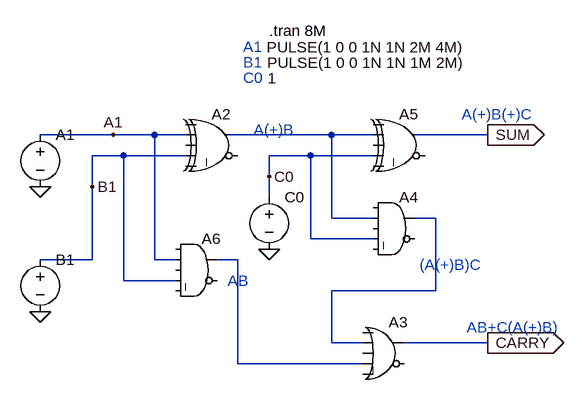
[diagram p0: schematic Draft29.asc]
Draft29.asc, the LTspice schematic file:
Version 4
SHEET 1 880 680
WIRE -16 16 -128 16
WIRE 48 16 -16 16
WIRE 96 16 48 16
WIRE 320 16 160 16
WIRE 384 16 320 16
WIRE 560 16 448 16
WIRE 0 48 -48 48
WIRE 96 48 0 48
WIRE 288 48 224 48
WIRE 384 48 288 48
WIRE 224 80 224 48
WIRE -48 96 -48 48
WIRE 224 112 224 80
WIRE 320 144 320 16
WIRE 384 144 320 144
WIRE 480 144 448 144
WIRE 288 176 288 48
WIRE 384 176 288 176
WIRE -48 208 -48 96
WIRE -48 208 -128 208
WIRE 48 208 48 16
WIRE 80 208 48 208
WIRE 176 208 144 208
WIRE 0 240 0 48
WIRE 80 240 0 240
WIRE 480 256 480 144
WIRE 480 256 320 256
WIRE 320 336 320 256
WIRE 368 336 320 336
WIRE 560 336 432 336
WIRE 176 368 176 208
WIRE 368 368 176 368
FLAG -128 96 0
FLAG -128 288 0
FLAG 224 192 0
FLAG 560 16 SUM
IOPIN 560 16 Out
FLAG 560 336 CARRY
IOPIN 560 336 Out
FLAG -16 16 A1
FLAG -48 96 B1
FLAG 224 80 C0
SYMBOL voltage -128 0 R0
WINDOW 3 348 -119 Left 2
WINDOW 123 0 0 Left 0
WINDOW 39 0 0 Left 0
SYMATTR Value PULSE(1 0 0 1N 1N 2M 4M)
SYMATTR InstName A1
SYMBOL voltage -128 192 R0
WINDOW 3 349 -287 Left 2
WINDOW 123 0 0 Left 0
WINDOW 39 0 0 Left 0
SYMATTR Value PULSE(1 0 0 1N 1N 1M 2M)
SYMATTR InstName B1
SYMBOL voltage 224 96 R0
WINDOW 3 -2 -167 Left 2
WINDOW 123 0 0 Left 0
WINDOW 39 0 0 Left 0
SYMATTR Value 1
SYMATTR InstName C0
SYMBOL Digital\\xor 144 -32 R0
SYMATTR InstName A2
SYMBOL Digital\\or 400 288 R0
SYMATTR InstName A3
SYMBOL Digital\\and 416 96 R0
SYMATTR InstName A4
SYMBOL Digital\\xor 432 -32 R0
SYMATTR InstName A5
SYMBOL Digital\\and 112 160 R0
SYMATTR InstName A6
TEXT 224 -144 Left 2 !.tran 8M
TEXT 200 8 Left 2 ;A(+)B
TEXT 520 -16 Left 2 ;A(+)B(+)C
TEXT 160 240 Left 2 ;AB
TEXT 456 216 Left 2 ;(A(+)B)C
TEXT 528 312 Left 2 ;AB+C(A(+)B)
TEXT 184 -120 Left 2 ;A1
TEXT 184 -96 Left 2 ;B1
TEXT 184 -72 Left 2 ;C0

The netlist it stands for:
* Draft29.asc
V§A1 A1 0 PULSE(1 0 0 1N 1N 2M 4M)
V§B1 B1 0 PULSE(1 0 0 1N 1N 1M 2M)
V§C0 C0 0 1
A2 0 A1 0 B1 0 0 N001 0 XOR
A3 0 N002 0 N003 0 0 CARRY 0 OR
A4 0 N001 0 C0 0 0 N002 0 AND
A5 0 N001 0 C0 0 0 SUM 0 XOR
A6 0 A1 0 B1 0 0 N003 0 AND
.tran 8M
* A(+)B
* A(+)B(+)C
* AB
* (A(+)B)C
* AB+C(A(+)B)
* A1
* B1
* C0
.backanno
.end

* Results of the author's LTspice run, read from the files saved beside the schematic
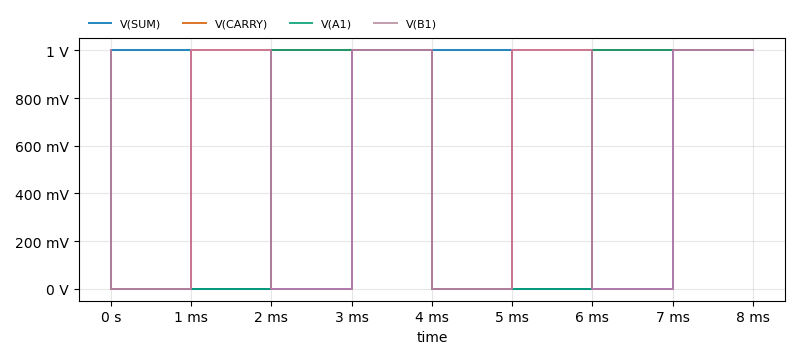
[diagram p1: Transient Analysis of Draft29.asc, plotted from the saved traces]
* Transient Analysis, 1 run:
*   V(SUM): min 0 V, max 1 V, average 500 mV, rms 707.1 mV, last 1 V
*   V(CARRY): min 0 V, max 1 V, average 750 mV, rms 866 mV, last 1 V
*   V(A1): min 0 V, max 1 V, average 500 mV, rms 707.1 mV, last 1 V
*   V(B1): min 0 V, max 1 V, average 500 mV, rms 707.1 mV, last 1 V